# Altium schematic sheet GPS.SchDoc
size A; Organization: Altium Limited; Address1: L3, 12a Rodborough Rd; Address2: Frenchs Forest; Address3: NSW; Address4: Australia 2086
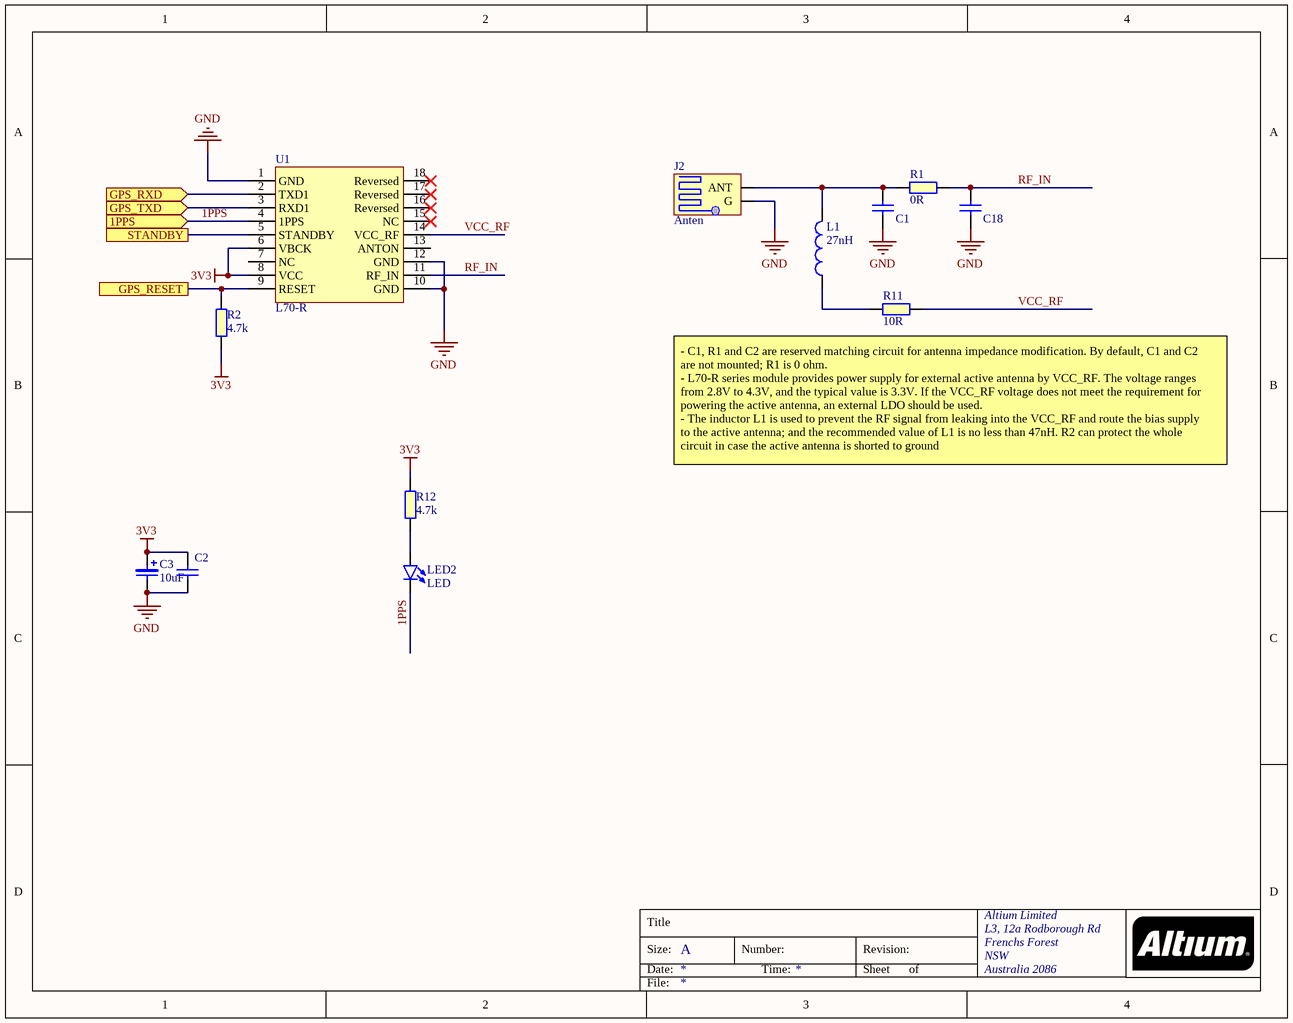
[diagram p0: GPS.SchDoc]

## Parts
C1  DNP  [C_0603]  (value not drawn)
C2  0.01uF  [C_0603]  (value not drawn)
C3  10uF  [CASE A]
C18  DNP  [C_0603]  (value not drawn)
J2  Anten  [ANTEN_IPEX]
L1  27nH  [INDUCTOR_0603]
LED2  LED  [LED_0603]
R1  0R  [R_0603]
R2  4.7k  [R_0603]
R11  10R  [R_0603]
R12  4.7k  [R_0603]
U1  L70-R  [MODULE_MAX-7Q]

## Ports
1PPS (in), GPS_RESET, GPS_RXD (in), GPS_TXD (in), STANDBY

## Nets
3V3: C2.2 C3.A R2.1 R12.2 U1.6(VBCK) U1.8(VCC)
GND: C1.2 C2.1 C3.K C18.2 J2.2(G) U1.1(GND) U1.10(GND) U1.12(GND)
1PPS: LED2.K U1.4(1PPS) ; port 1PPS
GPS_RESET: R2.2 U1.9(RESET) ; port GPS_RESET
GPS_RXD: U1.2(TXD1) ; port GPS_RXD
GPS_TXD: U1.3(RXD1) ; port GPS_TXD
RF_IN: C18.1 R1.1 U1.11(RF_IN)
STANDBY: U1.5(STANDBY) ; port STANDBY
VCC_RF: R11.1 U1.14(VCC_RF)
NetC1_1: C1.1 J2.1(ANT) L1.2 R1.2
NetL1_1: L1.1 R11.2
NetLED2_A: LED2.A R12.1

Not connected (* = marked no-connect by the designer): U1 7(NC) 13(ANTON) 15(NC)* 16(Reversed)* 17(Reversed)* 18(Reversed)*

## Notes on the sheet
- (near R11) - C1, R1 and C2 are reserved matching circuit for antenna impedance modification. By default, C1 and C2
  are not mounted; R1 is 0 ohm.
  - L70-R series module provides power supply for external active antenna by VCC_RF. The voltage ranges
  from 2.8V to 4.3V, and the typical value is 3.3V. If the VCC_RF voltage does not meet the requirement for
  powering the active antenna, an external LDO should be used.
  - The inductor L1 is used to prevent the RF signal from leaking into the VCC_RF and route the bias supply
  to the active antenna; and the recommended value of L1 is no less than 47nH. R2 can protect the whole
  circuit in case the active antenna is shorted to ground
- Title
- Size:
- Date:
- A
- Number:
- Time:
- Revision:
- Sheet
- of
- File:

## Library data of the parts
C1 C2 C18 = CAP_0603
C3 = Capacitor-Tantalium: CAP TANT 10UF 16V 10% 2917; Part Number: T491A106K010AT; Part Description: CAP TANT 10UF 10V 10% 1206; Manufacturer: KEMET; ID: 3; Voltage: 10VDC; Tolerance: 20%; Component Kind: Standard; Component Type: Standard; Pin Count: 2; Status: Not Recommended; Manufacturer Part Number: T491A106K010AT; Case: A CASE; Mounted: Yes; Socket: No; SMD: Yes; ComponentHeigh: https://www.mouser.vn; Manufacturer1 Example: MDBK; Value: 10uF
J2 = ANTEN_IPEX: CONN UMC RCPT STR 50 OHM SMD; Manufacturer: Taoglas; Manufacturer Part Number: RECE.20279.001E.01; Connector Type: Coaxial,Male Pin; Body Material: Brass; Body Plating: Gold; Gender: Male; Supplier 1: Digi-Key; Stock 1: 45630; Pricing 1: 1=0.75 (USD); Packaging: Tape and Reel; Fastening Type: Snap; Housing Color: White; Supplier Part Number 1: 931-1107-6-ND; Mount: Surface Mount; Case/Package: SMD/SMT; Contact Material: Brass; Contact Plating: Gold; Package Quantity: 1; Termination: Solder; Orientation: Straight
L1 = INDUCTOR_0603
LED2 = LED_0603
R1 R2 R11 R12 = RES_0603
U1 = L70-R: GPS Receiver 1575.42MHz 2.5V/3.3V 18-Pin; Manufacturer: Quectel Wireless Solutions; Manufacturer Part Number: L70R; Max Frequency: 1.57542GHz; Supplier 1: Avnet; Stock 1: 0; RoHS: Yes; Min Operating Temperature: -40°C; Max Operating Temperature: 85°C; Packaging: Tape and Reel; Radiation Hardening: No; ComponentLink1URL: https://datasheet.ciiva.com/48437/quectel-l70-r-gps-specification-v1-0-48437770.pdf?src-supplier=Avnet; ComponentLink1Description: https://datasheet.ciiva.com/48437/quectel-l70-r-gps-specification-v1-0-48437770.pdf?src-supplier=Avnet; Supplier Part Number 1: L70R-M37